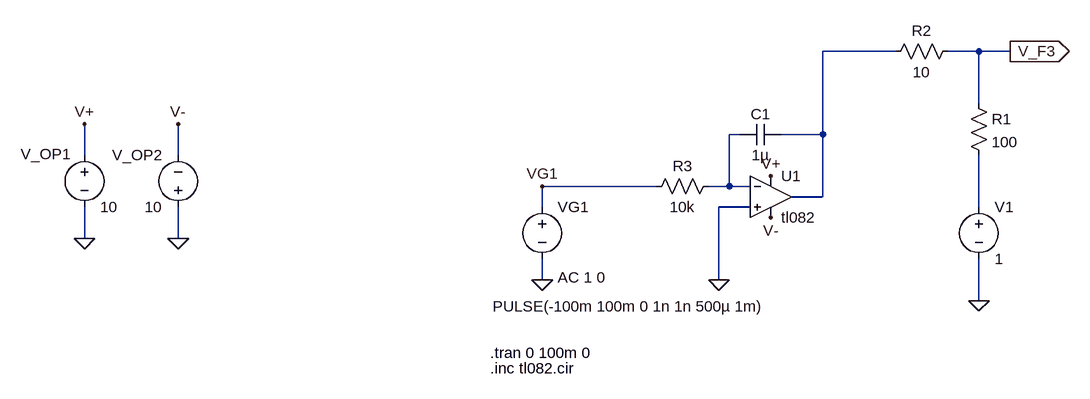
[diagram p0: schematic Integrator mit Quelle am Ausgang.asc]
Integrator mit Quelle am Ausgang.asc, the LTspice schematic file:
Version 4
SHEET 1 880 680
WIRE -144 -128 -256 -128
WIRE -16 -128 -64 -128
WIRE 32 -128 -16 -128
WIRE -16 -48 -16 -128
WIRE -384 0 -400 0
WIRE -256 0 -256 -128
WIRE -256 0 -320 0
WIRE -1392 32 -1392 -16
WIRE -1248 32 -1248 -16
WIRE -512 80 -688 80
WIRE -400 80 -400 0
WIRE -400 80 -432 80
WIRE -368 80 -400 80
WIRE -256 96 -256 0
WIRE -256 96 -304 96
WIRE -688 112 -688 80
WIRE -368 112 -416 112
WIRE -16 112 -16 32
WIRE -1392 160 -1392 112
WIRE -1248 160 -1248 112
WIRE -688 224 -688 192
WIRE -416 224 -416 112
WIRE -16 256 -16 192
FLAG -416 224 0
FLAG -16 256 0
FLAG -336 64 V+
FLAG -336 128 V-
FLAG 32 -128 V_F3
IOPIN 32 -128 Out
FLAG -688 224 0
FLAG -1248 160 0
FLAG -1392 160 0
FLAG -1392 -16 V+
FLAG -1248 -16 V-
FLAG -688 80 VG1
SYMBOL Opamps\\opamp2 -336 32 R0
SYMATTR InstName U1
SYMATTR Value tl082
SYMBOL voltage -16 96 R0
WINDOW 123 0 0 Left 0
WINDOW 39 0 0 Left 0
SYMATTR InstName V1
SYMATTR Value 1
SYMBOL res -32 -64 R0
SYMATTR InstName R1
SYMATTR Value 100
SYMBOL res -48 -144 R90
WINDOW 0 0 56 VBottom 2
WINDOW 3 32 56 VTop 2
SYMATTR InstName R2
SYMATTR Value 10
SYMBOL res -416 64 R90
WINDOW 0 0 56 VBottom 2
WINDOW 3 32 56 VTop 2
SYMATTR InstName R3
SYMATTR Value 10k
SYMBOL cap -320 -16 R90
WINDOW 0 0 32 VBottom 2
WINDOW 3 32 32 VTop 2
SYMATTR InstName C1
SYMATTR Value 1µ
SYMBOL voltage -688 96 R0
WINDOW 3 -76 169 Left 2
WINDOW 123 24 124 Left 2
WINDOW 39 0 0 Left 0
SYMATTR Value PULSE(-100m 100m 0 1n 1n 500µ 1m)
SYMATTR Value2 AC 1 0
SYMATTR InstName VG1
SYMBOL voltage -1392 16 R0
WINDOW 123 0 0 Left 0
WINDOW 39 0 0 Left 0
WINDOW 0 -98 14 Left 2
SYMATTR InstName V_OP1
SYMATTR Value 10
SYMBOL voltage -1248 128 R180
WINDOW 0 24 96 Left 2
WINDOW 3 24 16 Left 2
WINDOW 123 0 0 Left 0
WINDOW 39 0 0 Left 0
SYMATTR InstName V_OP2
SYMATTR Value 10
TEXT -768 336 Left 2 !.tran 0 100m 0
TEXT -768 360 Left 2 !.inc tl082.cir

The netlist it stands for:
* Integrator mit Quelle am Ausgang.asc
XU1 0 N002 V+ V- N001 tl082  ; pins In+ In- V+ V- OUT
V1 N003 0 1
R1 V_F3 N003 100
R2 V_F3 N001 10
R3 N002 VG1 10k
C1 N001 N002 1µ
VG1 VG1 0 PULSE(-100m 100m 0 1n 1n 500µ 1m) AC 1 0
V_OP1 V+ 0 10
V_OP2 0 V- 10
.tran 0 100m 0
.inc tl082.cir
.backanno
.end